# Altium schematic sheet MB1297_MCU1.SchDoc: MCU 1/2
size A4; Date: Not used; ApprovedBy: Not used; CheckedBy: Not used; Author: Not used; CompanyName: STMicroelectronics; DrawnBy: Not used; Engineer: Not used; Organization: Not used; Address1: Not used; Address2: Not used; Address3: Not used; Address4: Not used; DocumentNumber: Not used; Revision: Not used; SheetNumber: 3; SheetTotal: 12; CurrentTime: Not used; CurrentDate: Not used; Time: Not used; DocumentFullPathAndName: Not used; DocumentName: Not used; ModifiedDate: Not used; ImagePath: Not used; ProjectName: Not used; Application_BuildNumber: Not used
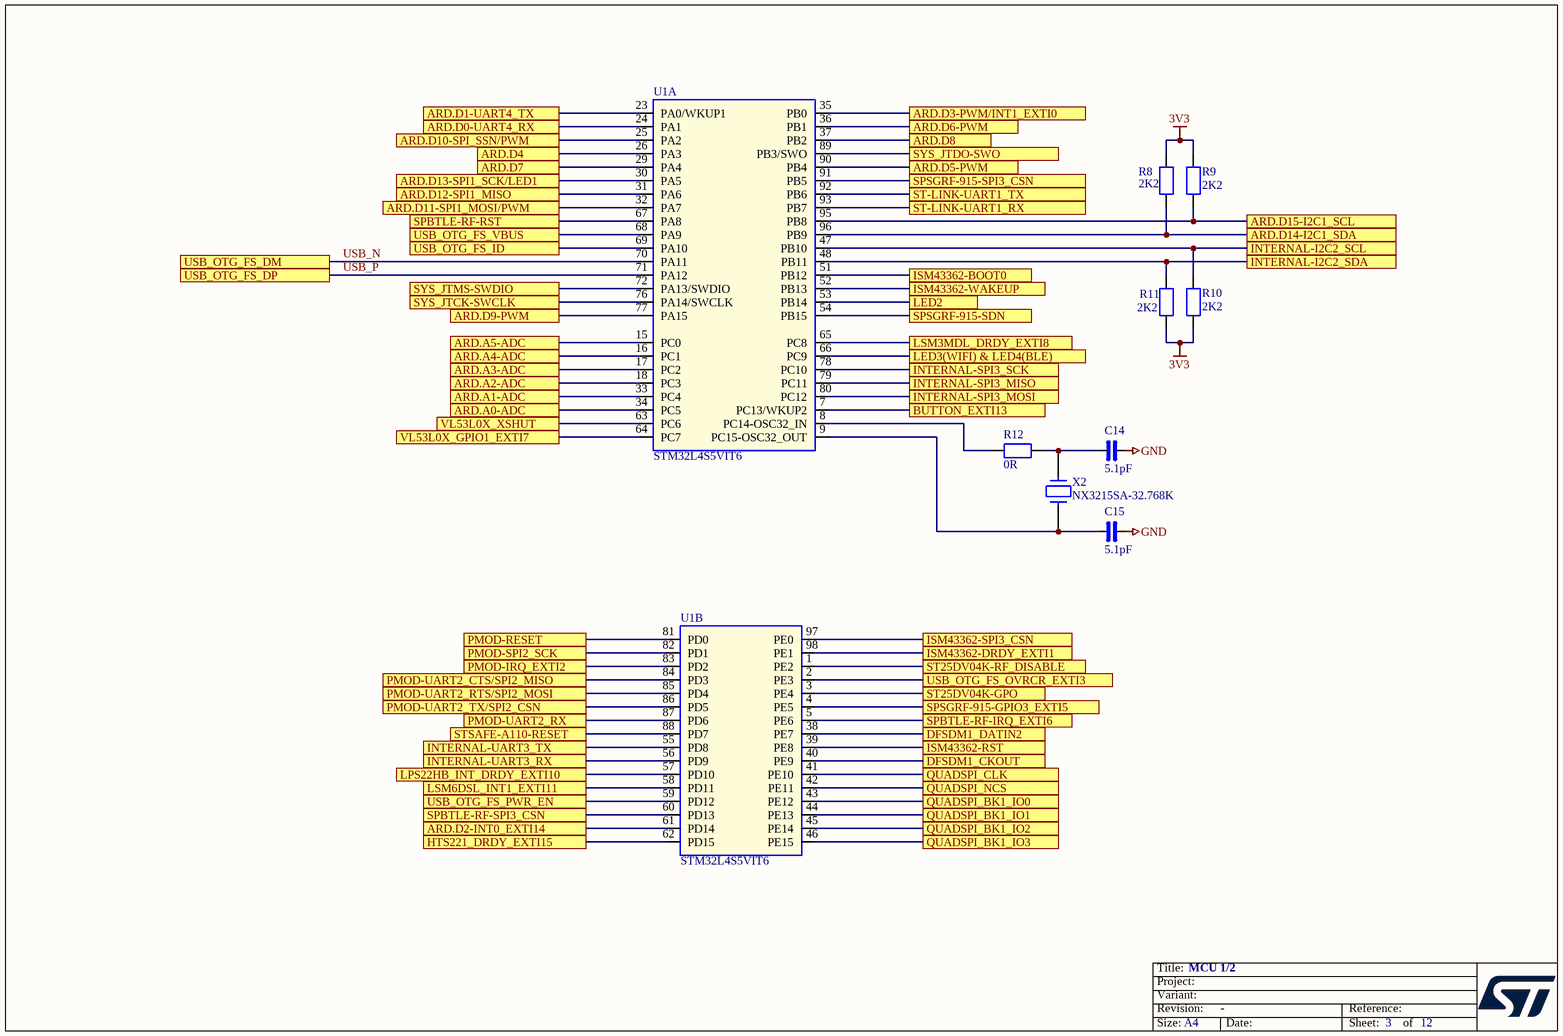
[diagram p0: MB1297_MCU1.SchDoc]

## Parts
C14  5.1pF  [0402]
C15  5.1pF  [0402]
R8  2K2  [0402]
R9  2K2  [0402]
R10  2K2  [0402]
R11  2K2  [0402]
R12  0R  [0402]
U1  STM32L4S5VIT6  [LQFP100 14x14x1.6]  (parts A,B of 3)
X2  NX3215SA-32.768K  [CRY_NX3215SA_2P]

## Ports
ARD.A0-ADC, ARD.A1-ADC, ARD.A2-ADC, ARD.A3-ADC, ARD.A4-ADC, ARD.A5-ADC, ARD.D0-UART4_RX, ARD.D1-UART4_TX, ARD.D2-INT0_EXTI14, ARD.D3-PWM/INT1_EXTI0, ARD.D4, ARD.D5-PWM, ARD.D6-PWM, ARD.D7, ARD.D8, ARD.D9-PWM, ARD.D10-SPI_SSN/PWM, ARD.D11-SPI1_MOSI/PWM, ARD.D12-SPI1_MISO, ARD.D13-SPI1_SCK/LED1, ARD.D14-I2C1_SDA, ARD.D15-I2C1_SCL, BUTTON_EXTI13, DFSDM1_CKOUT, DFSDM1_DATIN2, HTS221_DRDY_EXTI15, INTERNAL-I2C2_SCL, INTERNAL-I2C2_SDA, INTERNAL-SPI3_MISO, INTERNAL-SPI3_MOSI, INTERNAL-SPI3_SCK, INTERNAL-UART3_RX, INTERNAL-UART3_TX, ISM43362-BOOT0, ISM43362-DRDY_EXTI1, ISM43362-RST, ISM43362-SPI3_CSN, ISM43362-WAKEUP, LED2, LED3(WIFI) & LED4(BLE), LPS22HB_INT_DRDY_EXTI10, LSM3MDL_DRDY_EXTI8, LSM6DSL_INT1_EXTI11, PMOD-IRQ_EXTI2, PMOD-RESET, PMOD-SPI2_SCK, PMOD-UART2_CTS/SPI2_MISO, PMOD-UART2_RTS/SPI2_MOSI, PMOD-UART2_RX, PMOD-UART2_TX/SPI2_CSN, QUADSPI_BK1_IO0, QUADSPI_BK1_IO1, QUADSPI_BK1_IO2, QUADSPI_BK1_IO3, QUADSPI_CLK, QUADSPI_NCS, SPBTLE-RF-IRQ_EXTI6, SPBTLE-RF-RST, SPBTLE-RF-SPI3_CSN, SPSGRF-915-GPIO3_EXTI5, SPSGRF-915-SDN, SPSGRF-915-SPI3_CSN, ST25DV04K-GPO, ST25DV04K-RF_DISABLE, ST-LINK-UART1_RX, ST-LINK-UART1_TX, STSAFE-A110-RESET, SYS_JTCK-SWCLK, SYS_JTDO-SWO, SYS_JTMS-SWDIO, USB_OTG_FS_DM, USB_OTG_FS_DP, USB_OTG_FS_ID, USB_OTG_FS_OVRCR_EXTI3, USB_OTG_FS_PWR_EN, USB_OTG_FS_VBUS, VL53L0X_GPIO1_EXTI7, VL53L0X_XSHUT

## Nets
3V3: R8.1 R9.1 R10.1 R11.1
GND: C14.2 C15.2
ARD.A0-ADC: U1.34(PC5) ; port ARD.A0-ADC
ARD.A1-ADC: U1.33(PC4) ; port ARD.A1-ADC
ARD.A2-ADC: U1.18(PC3) ; port ARD.A2-ADC
ARD.A3-ADC: U1.17(PC2) ; port ARD.A3-ADC
ARD.A4-ADC: U1.16(PC1) ; port ARD.A4-ADC
ARD.A5-ADC: U1.15(PC0) ; port ARD.A5-ADC
ARD.D0-UART4_RX: U1.24(PA1) ; port ARD.D0-UART4_RX
ARD.D1-UART4_TX: U1.23(PA0/WKUP1) ; port ARD.D1-UART4_TX
ARD.D2-INT0_EXTI14: U1.61(PD14) ; port ARD.D2-INT0_EXTI14
ARD.D3-PWM/INT1_EXTI0: U1.35(PB0) ; port ARD.D3-PWM/INT1_EXTI0
ARD.D4: U1.26(PA3) ; port ARD.D4
ARD.D5-PWM: U1.90(PB4) ; port ARD.D5-PWM
ARD.D6-PWM: U1.36(PB1) ; port ARD.D6-PWM
ARD.D7: U1.29(PA4) ; port ARD.D7
ARD.D8: U1.37(PB2) ; port ARD.D8
ARD.D9-PWM: U1.77(PA15) ; port ARD.D9-PWM
ARD.D10-SPI_SSN/PWM: U1.25(PA2) ; port ARD.D10-SPI_SSN/PWM
ARD.D11-SPI1_MOSI/PWM: U1.32(PA7) ; port ARD.D11-SPI1_MOSI/PWM
ARD.D12-SPI1_MISO: U1.31(PA6) ; port ARD.D12-SPI1_MISO
ARD.D13-SPI1_SCK/LED1: U1.30(PA5) ; port ARD.D13-SPI1_SCK/LED1
ARD.D14-I2C1_SDA: R8.2 U1.96(PB9) ; port ARD.D14-I2C1_SDA
ARD.D15-I2C1_SCL: R9.2 U1.95(PB8) ; port ARD.D15-I2C1_SCL
BUTTON_EXTI13: U1.7(PC13/WKUP2) ; port BUTTON_EXTI13
DFSDM1_CKOUT: U1.40(PE9) ; port DFSDM1_CKOUT
DFSDM1_DATIN2: U1.38(PE7) ; port DFSDM1_DATIN2
HTS221_DRDY_EXTI15: U1.62(PD15) ; port HTS221_DRDY_EXTI15
INTERNAL-I2C2_SCL: R10.2 U1.47(PB10) ; port INTERNAL-I2C2_SCL
INTERNAL-I2C2_SDA: R11.2 U1.48(PB11) ; port INTERNAL-I2C2_SDA
INTERNAL-SPI3_MISO: U1.79(PC11) ; port INTERNAL-SPI3_MISO
INTERNAL-SPI3_MOSI: U1.80(PC12) ; port INTERNAL-SPI3_MOSI
INTERNAL-SPI3_SCK: U1.78(PC10) ; port INTERNAL-SPI3_SCK
INTERNAL-UART3_RX: U1.56(PD9) ; port INTERNAL-UART3_RX
INTERNAL-UART3_TX: U1.55(PD8) ; port INTERNAL-UART3_TX
ISM43362-BOOT0: U1.51(PB12) ; port ISM43362-BOOT0
ISM43362-DRDY_EXTI1: U1.98(PE1) ; port ISM43362-DRDY_EXTI1
ISM43362-RST: U1.39(PE8) ; port ISM43362-RST
ISM43362-SPI3_CSN: U1.97(PE0) ; port ISM43362-SPI3_CSN
ISM43362-WAKEUP: U1.52(PB13) ; port ISM43362-WAKEUP
LED2: U1.53(PB14) ; port LED2
LED3(WIFI) & LED4(BLE): U1.66(PC9) ; port LED3(WIFI) & LED4(BLE)
LPS22HB_INT_DRDY_EXTI10: U1.57(PD10) ; port LPS22HB_INT_DRDY_EXTI10
LSM3MDL_DRDY_EXTI8: U1.65(PC8) ; port LSM3MDL_DRDY_EXTI8
LSM6DSL_INT1_EXTI11: U1.58(PD11) ; port LSM6DSL_INT1_EXTI11
PMOD-IRQ_EXTI2: U1.83(PD2) ; port PMOD-IRQ_EXTI2
PMOD-RESET: U1.81(PD0) ; port PMOD-RESET
PMOD-SPI2_SCK: U1.82(PD1) ; port PMOD-SPI2_SCK
PMOD-UART2_CTS/SPI2_MISO: U1.84(PD3) ; port PMOD-UART2_CTS/SPI2_MISO
PMOD-UART2_RTS/SPI2_MOSI: U1.85(PD4) ; port PMOD-UART2_RTS/SPI2_MOSI
PMOD-UART2_RX: U1.87(PD6) ; port PMOD-UART2_RX
PMOD-UART2_TX/SPI2_CSN: U1.86(PD5) ; port PMOD-UART2_TX/SPI2_CSN
QUADSPI_BK1_IO0: U1.43(PE12) ; port QUADSPI_BK1_IO0
QUADSPI_BK1_IO1: U1.44(PE13) ; port QUADSPI_BK1_IO1
QUADSPI_BK1_IO2: U1.45(PE14) ; port QUADSPI_BK1_IO2
QUADSPI_BK1_IO3: U1.46(PE15) ; port QUADSPI_BK1_IO3
QUADSPI_CLK: U1.41(PE10) ; port QUADSPI_CLK
QUADSPI_NCS: U1.42(PE11) ; port QUADSPI_NCS
SPBTLE-RF-IRQ_EXTI6: U1.5(PE6) ; port SPBTLE-RF-IRQ_EXTI6
SPBTLE-RF-RST: U1.67(PA8) ; port SPBTLE-RF-RST
SPBTLE-RF-SPI3_CSN: U1.60(PD13) ; port SPBTLE-RF-SPI3_CSN
SPSGRF-915-GPIO3_EXTI5: U1.4(PE5) ; port SPSGRF-915-GPIO3_EXTI5
SPSGRF-915-SDN: U1.54(PB15) ; port SPSGRF-915-SDN
SPSGRF-915-SPI3_CSN: U1.91(PB5) ; port SPSGRF-915-SPI3_CSN
ST25DV04K-GPO: U1.3(PE4) ; port ST25DV04K-GPO
ST25DV04K-RF_DISABLE: U1.1(PE2) ; port ST25DV04K-RF_DISABLE
ST-LINK-UART1_RX: U1.93(PB7) ; port ST-LINK-UART1_RX
ST-LINK-UART1_TX: U1.92(PB6) ; port ST-LINK-UART1_TX
STSAFE-A110-RESET: U1.88(PD7) ; port STSAFE-A110-RESET
SYS_JTCK-SWCLK: U1.76(PA14/SWCLK) ; port SYS_JTCK-SWCLK
SYS_JTDO-SWO: U1.89(PB3/SWO) ; port SYS_JTDO-SWO
SYS_JTMS-SWDIO: U1.72(PA13/SWDIO) ; port SYS_JTMS-SWDIO
USB_N: U1.70(PA11) ; port USB_OTG_FS_DM
USB_OTG_FS_ID: U1.69(PA10) ; port USB_OTG_FS_ID
USB_OTG_FS_OVRCR_EXTI3: U1.2(PE3) ; port USB_OTG_FS_OVRCR_EXTI3
USB_OTG_FS_PWR_EN: U1.59(PD12) ; port USB_OTG_FS_PWR_EN
USB_OTG_FS_VBUS: U1.68(PA9) ; port USB_OTG_FS_VBUS
USB_P: U1.71(PA12) ; port USB_OTG_FS_DP
VL53L0X_GPIO1_EXTI7: U1.64(PC7) ; port VL53L0X_GPIO1_EXTI7
VL53L0X_XSHUT: U1.63(PC6) ; port VL53L0X_XSHUT
NetC14_1: C14.1 R12.2 X2.1
NetC15_1: C15.1 U1.9(PC15-OSC32_OUT) X2.2
NetR12_1: R12.1 U1.8(PC14-OSC32_IN)

## Notes on the sheet
- Title:
- Project:
- Size:
- Revision:
- Variant:
- A4
- -
- Date:
- Reference:
- Sheet:
- of

## Library data of the parts
C14 C15 = CAP_NPOL: Capacitor_not polarized
R8-R12 = RES: Resistor
U1 = STM32L475VGTx
X2 = XTAL_32K_NX3215SA: Crystal 32.768kHz, 6pF, -+20PPM, R=50K, SMD; Manuf_1: NDK; Manuf_Part_1: NX3215SA 32.768KHz EXS00A-MU00525; ECCN_US/EU: EAR99/NEC; Ref St: 9157034; NDK Ref: X3101802; Fitted: YES; Ordered_By: STM; Distrib: *; Order_Code: NX3215SA 32.768KHz EXS00A-MU00525; Value: NX3215SA-32.768K